# Altium schematic sheet Humidifier.SchDoc
size A2
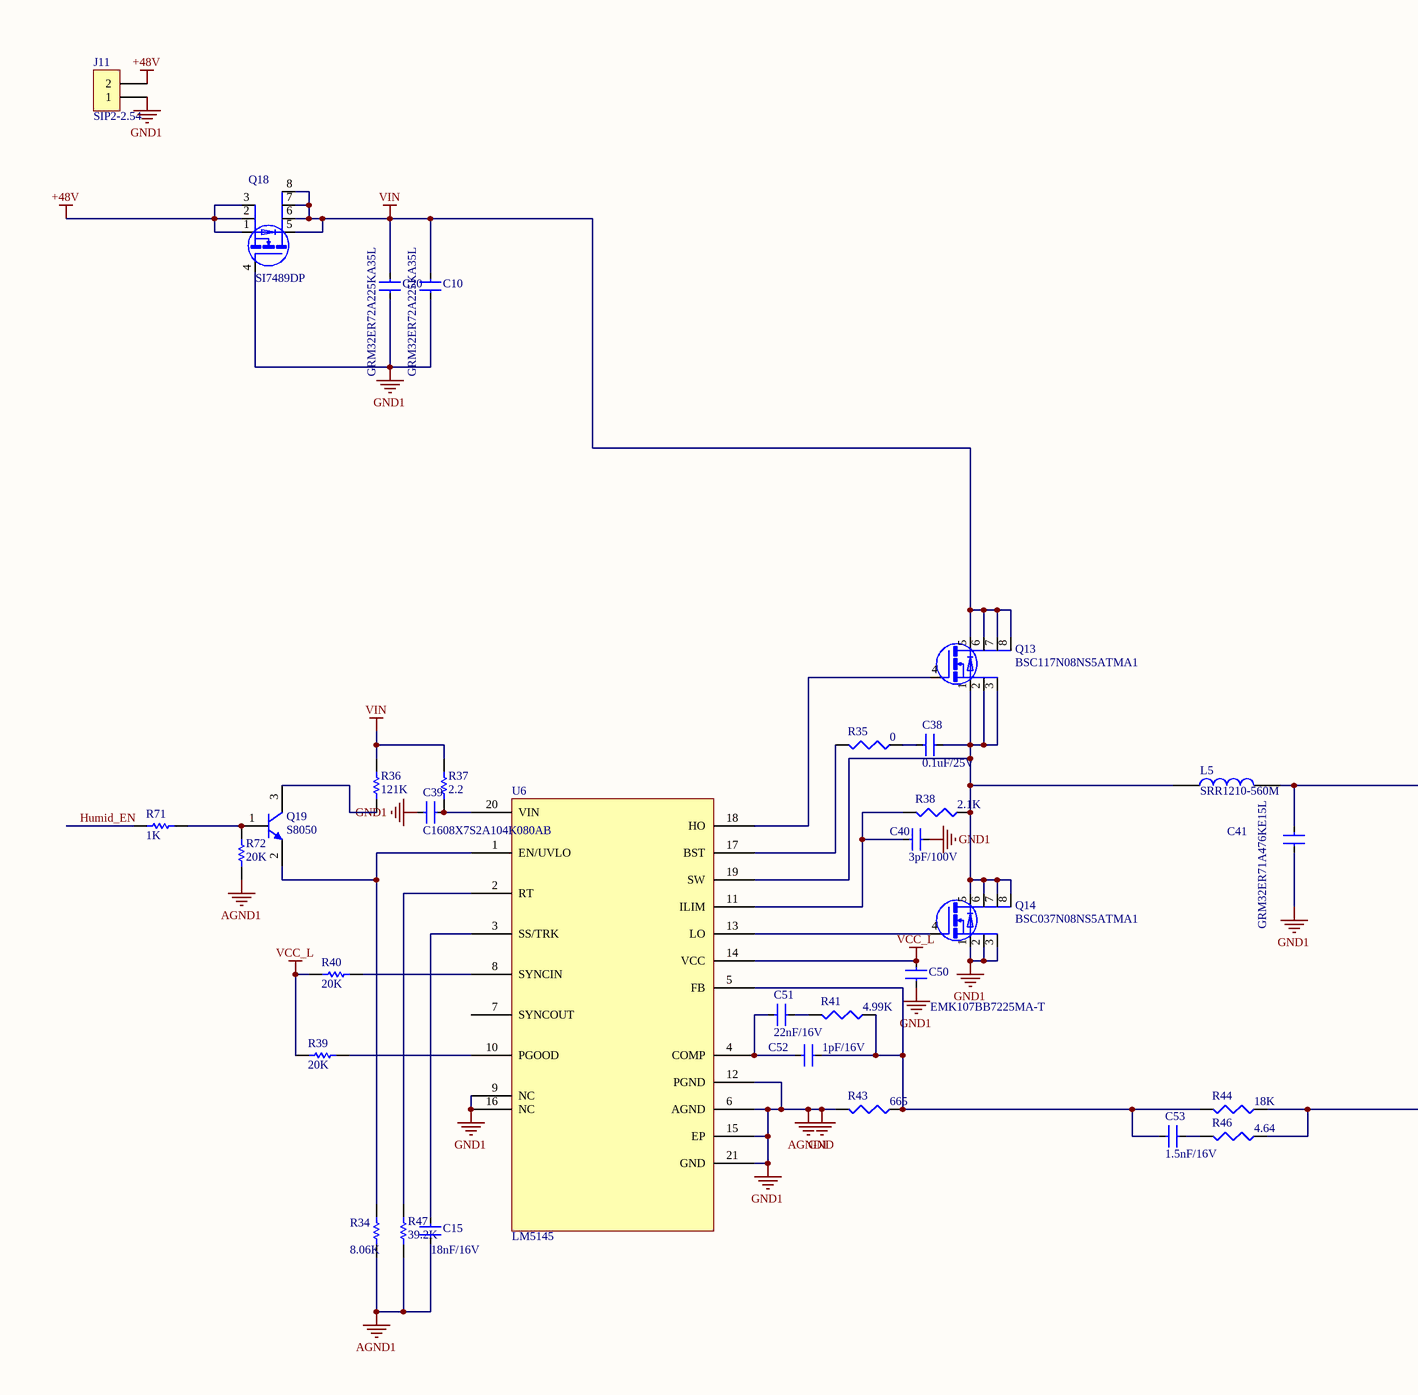
[diagram p0: Humidifier.SchDoc, left]
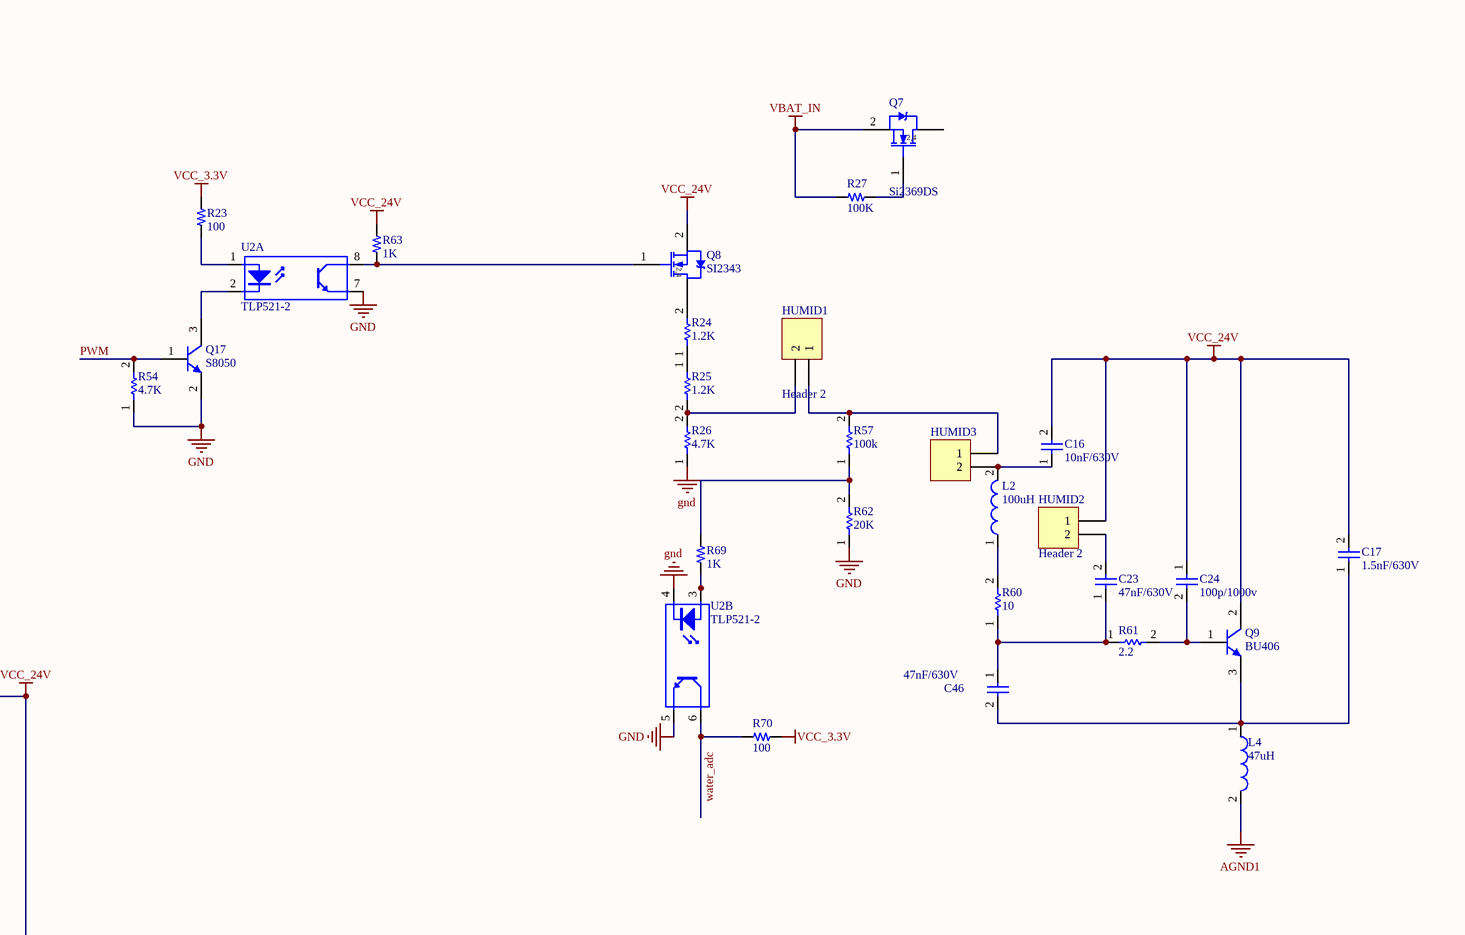
[diagram p1: Humidifier.SchDoc, right]

## Parts
C10  GRM32ER72A225KA35L  [1210C]
C15  18nF/16V  [0603C]
C16  10nF/630V  [CAP_5MM]
C17  1.5nF/630V  [AXIAL-0.3]
C20  GRM32ER72A225KA35L  [1210C]
C23  47nF/630V  [AXIAL-0.4]
C24  100p/1000v  [CAP_5MM]
C38  0.1uF/25V  [0603C]
C39  C1608X7S2A104K080AB  [0603C]
C40  3pF/100V  [0603C]
C41  GRM32ER71A476KE15L  [1210C]
C46  47nF/630V  [AXIAL-0.4]
C50  EMK107BB7225MA-T  [0603C]
C51  22nF/16V  [0603C]
C52  1pF/16V  [0603C]
C53  1.5nF/16V  [0603C]
HUMID1  Header 2  [SIP-2L]
HUMID2  Header 2  [SIP-2L]
HUMID3  (no value)  [SIP-2L]
J11  SIP2-2.54  [CH3.96-2P]
L2  100uH  [AXIAL-0.5]
L4  47uH  [6*8]
L5  SRR1210-560M  [SRR1210]
Q7  Si2369DS  [SOT23-3]
Q8  SI2343  [SOT23-3]
Q9  BU406  [to220]
Q13  BSC117N08NS5ATMA1  [PowerPAK SO-8]
Q14  BSC037N08NS5ATMA1  [PowerPAK SO-8]
Q17  S8050  [SOT23-3]
Q18  SI7489DP  [PowerPAK SO-8]
Q19  S8050  [SOT23-3]
R23  100  [0603R]
R24  1.2K  [AXIAL-0.4]
R25  1.2K  [AXIAL-0.4]
R26  4.7K  [AXIAL-0.4]
R27  100K  [0603R]
R34  8.06K  [0603R]
R35  0  [0603R]
R36  121K  [0805R]
R37  2.2  [0603R]
R38  2.1K  [0603R]
R39  20K  [0603R]
R40  20K  [0603R]
R41  4.99K  [0603R]
R43  665  [0603R]
R44  18K  [0603R]
R46  4.64  [0603R]
R47  39.2K  [0603R]
R54  4.7K  [0603r]
R57  100k  [0603r]
R60  10  [AXIAL-0.4]
R61  2.2  [AXIAL-0.4]
R62  20K  [0603r]
R63  1K  [0603R]
R69  1K  [0603R]
R70  100  [0603R]
R71  1K  [0603R]
R72  20K  [0603R]
U2  TLP521-2  [SO-8]  (parts A,B of 2)
U6  LM5145  [QFN050P600-8N]

## Nets
+48V: J11.2 Q18.1(S) Q18.2(S) Q18.3(S)
AGND1: C10.2 C15.2 C20.2 C39.1 C40.1 C41.2 C50.2 J11.1 L4.2 Q14.1(S) Q14.2(S) Q14.3(S) Q17.2(E) Q18.4(G) R26.1 R34.1 R43.2 R47.1 R54.1 R62.1 R72.2 U2.4(K) U2.5(E) U2.7(E) U6.6(AGND) U6.9(NC) U6.12(PGND) U6.15(EP) U6.16(NC) U6.21(GND)  [also labelled gnd, GND1]
VBAT_IN: Q7.2(S) R27.1
VCC_3.3V: R23.2 R70.2
VCC_24V: C16.2 C17.2 C24.1 C41.1 HUMID2.1 L5.2 Q8.2(S) Q9.2(C) R44.1 R46.1 R63.2
VCC_L: C50.1 R39.2 R40.2 U6.14(VCC)
VIN: C10.1 C20.1 Q13.5(D) Q13.6(D) Q13.7(D) Q13.8(D) Q18.5(D) Q18.6(D) Q18.7(D) Q18.8(D) R36.2 R37.1
Humid_EN: R71.1
PWM: Q17.1(B) R54.2
water_adc: R70.1 U2.6(C)
NetC15_1: C15.1 U6.3(SS/TRK)
NetC16_1: C16.1 HUMID3.2 L2.2
NetC17_1: C17.1 C46.2 L4.1 Q9.3(E)
NetC23_1: C23.1 C46.1 R60.1 R61.1
NetC23_2: C23.2 HUMID2.2
NetC24_2: C24.2 Q9.1(B) R61.2
NetC38_1: C38.1 R35.1
NetC38_2: C38.2 L5.1 Q13.1(S) Q13.2(S) Q13.3(S) Q14.5(D) Q14.6(D) Q14.7(D) Q14.8(D) R38.1 U6.19(SW)
NetC39_2: C39.2 R37.2 U6.20(VIN)
NetC40_2: C40.2 R38.2 U6.11(ILIM)
NetC51_1: C51.1 C52.1 U6.4(COMP)
NetC51_2: C51.2 R41.2
NetC52_2: C52.2 C53.1 R41.1 R43.1 R44.2 U6.5(FB)
NetC53_2: C53.2 R46.2
NetHUMID1_1: HUMID1.1 HUMID3.1 R57.2
NetHUMID1_2: HUMID1.2 R25.2 R26.2
NetL2_1: L2.1 R60.2
NetQ7_1: Q7.1(G) R27.2
NetQ8_1: Q8.1(G) R63.1 U2.8(C)
NetQ8_3: Q8.3(D) R24.2
NetQ13_4: Q13.4(G) U6.18(HO)
NetQ14_4: Q14.4(G) U6.13(LO)
NetQ17_3: Q17.3(C) U2.2(K)
NetQ19_1: Q19.1(B) R71.2 R72.1
NetQ19_2: Q19.2(E) R34.2 U6.1(EN/UVLO)
NetQ19_3: Q19.3(C) R36.1
NetR23_1: R23.1 U2.1(A)
NetR24_1: R24.1 R25.1
NetR35_2: R35.2 U6.17(BST)
NetR39_1: R39.1 U6.10(PGOOD)
NetR40_1: R40.1 U6.8(SYNCIN)
NetR47_2: R47.2 U6.2(RT)
NetR57_1: R57.1 R62.2 R69.2
NetR69_1: R69.1 U2.3(A)

Not connected (* = marked no-connect by the designer): Q7 3(D); U6 7(SYNCOUT)

## Notes on the sheet
- (in symbol BUK92150-55A) 2,4

## Library data of the parts
C10 C15 C20 C38-C41 C50-C53 = 0.01UF: CCX85-103
C16 C17 C23 C24 C46 = Cap: Capacitor; Value: 1nF/100V; Published: 8-Jun-2000; LatestRevisionDate: 17-Jul-2002; LatestRevisionNote: Re-released for DXP Platform.; PackageReference: RAD-0.3; Publisher: Altium Limited
HUMID1-HUMID3 = Header 2: Header, 2-Pin; LatestRevisionDate: 17-Jul-2002; LatestRevisionNote: Re-released for DXP Platform.; Publisher: Altium Limited
J11 = SIP2-2.54: CN-SIP2-2.54
L2 L4 = Inductor: Code_IEC: 1005; Value: 10uH; Published: 8-Jun-2000; LatestRevisionDate: 29-May-2009; LatestRevisionNote: IPC-7351 Footprint Added.; PackageReference: 0402-A; Publisher: Altium Limited; PackageDescription: Chip Inductor; Code_JEITA: 0402
L5 = INDUCTOR
Q7 Q8 = BUK92150-55A: Published: 8-Jun-2000; LatestRevisionDate: 17-Jul-2002; LatestRevisionNote: Re-released for DXP Platform.; DatasheetVersion: 6-Oct-1997; PackageVersion: Aug-1998; PackageReference: TSOP-6; Publisher: Altium Limited; PackageDescription: SOT-457/SC-74; 6 Leads; Body 3.1 x 3 mm, inc. leads (LxW max); ComponentLink1Description: Manufacturer Link; ComponentLink1URL: http://www.vishay.com/; ComponentLink2Description: Datasheet; ComponentLink2URL: http://www.vishay.com/docs/70192/70192.pdf
Q9 = NPN: NPN Bipolar Transistor; Published: 8-Jun-2000; LatestRevisionDate: 17-Jul-2002; LatestRevisionNote: Re-released for DXP Platform.; PackageReference: TO-226; Publisher: Altium Limited; Code_JEDEC: TO-226-AA
Q13 Q14 Q18 = Si4004DY
Q17 Q19 = NPN
R23 R27 R63 R69 R70 = R
R24-R26 R34 R36 R37 R39 R40 R47 R54 R57 R60-R62 R72 = Res Semi: Semiconductor Resistor; Value: 1K; Published: 8-Jun-2000; LatestRevisionDate: 17-Jul-2002; LatestRevisionNote: Re-released for DXP Platform.; PackageReference: AXIAL-0.5; Publisher: Altium Limited
R35 R38 R41 R43 R44 R46 = Res3: Resistor; Published: 8-Jun-2000; LatestRevisionDate: 29-May-2009; LatestRevisionNote: IPC-7351 Footprint Added.; PackageReference: J1-0603; Publisher: Altium Limited; PackageDescription: Chip Resistor
R71 = Res Semi: Semiconductor Resistor; Published: 8-Jun-2000; LatestRevisionDate: 17-Jul-2002; LatestRevisionNote: Re-released for DXP Platform.; PackageReference: AXIAL-0.5; Publisher: Altium Limited; Value: 1K